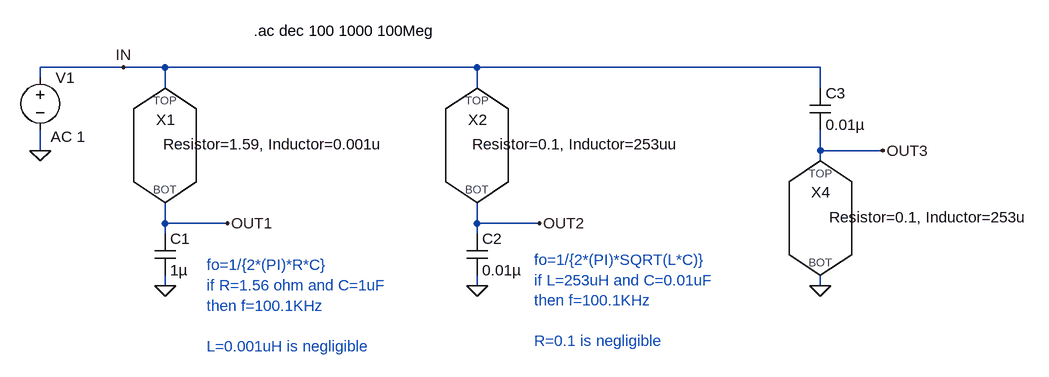
[diagram p0: schematic Fig_2-178_RL_Network-TOP_AC.asc]
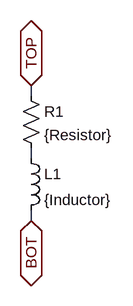
[diagram p1: sub-circuit fig_2-173_rl_element.asc]
Fig_2-178_RL_Network-TOP_AC.asc, the LTspice schematic file:
Version 4
SHEET 1 1832 680
WIRE 96 64 -32 64
WIRE 160 64 96 64
WIRE 640 64 160 64
WIRE 1168 64 640 64
WIRE -32 80 -32 64
WIRE 160 96 160 64
WIRE 640 96 640 64
WIRE 1168 96 1168 64
WIRE -32 192 -32 160
WIRE 1168 192 1168 160
WIRE 1264 192 1168 192
WIRE 1168 208 1168 192
WIRE 160 304 160 272
WIRE 256 304 160 304
WIRE 640 304 640 272
WIRE 736 304 640 304
WIRE 160 320 160 304
WIRE 640 320 640 304
WIRE 160 400 160 384
WIRE 640 400 640 384
WIRE 1168 400 1168 384
FLAG 160 400 0
FLAG -32 192 0
FLAG 256 304 OUT1
FLAG 640 400 0
FLAG 736 304 OUT2
FLAG 96 64 IN
FLAG 1168 400 0
FLAG 1264 192 OUT3
SYMBOL voltage -32 64 R0
WINDOW 3 -163 109 Left 2
WINDOW 123 16 107 Left 2
WINDOW 39 0 0 Left 2
SYMATTR Value ""
SYMATTR Value2 AC 1
SYMATTR InstName V1
SYMBOL cap 144 320 R0
SYMATTR InstName C1
SYMATTR Value 1µ
SYMBOL cap 624 320 R0
SYMATTR InstName C2
SYMATTR Value 0.01µ
SYMBOL cap 1152 96 R0
SYMATTR InstName C3
SYMATTR Value 0.01µ
SYMBOL Fig_2-173_RL_Element 160 160 R0
WINDOW 3 167 38 Bottom 2
SYMATTR InstName X1
SYMATTR Value Resistor=1.59, Inductor=0.001u
SYMATTR SpiceModel Fig_2-173_RL_Element.asc
SYMBOL Fig_2-173_RL_Element 640 160 R0
WINDOW 3 152 38 Bottom 2
SYMATTR InstName X2
SYMATTR Value Resistor=0.1, Inductor=253uu
SYMBOL Fig_2-173_RL_Element 1168 272 R0
WINDOW 3 167 38 Bottom 2
SYMATTR InstName X4
SYMATTR Value Resistor=0.1, Inductor=253u
SYMATTR SpiceModel Fig_2-173_RL_Element.asc
TEXT 296 8 Left 2 !.ac dec 100 1000 100Meg
TEXT 224 368 Left 2 ;fo=1/{2*(PI)*R*C}\nif R=1.56 ohm and C=1uF\nthen f=100.1KHz\n \nL=0.001uH is negligible
TEXT 728 360 Left 2 ;fo=1/{2*(PI)*SQRT(L*C)}\nif L=253uH and C=0.01uF\nthen f=100.1KHz\n \nR=0.1 is negligible

fig_2-173_rl_element.asc, the sub-circuit schematic file:
Version 4
SHEET 1 880 680
WIRE 192 96 192 80
WIRE 192 192 192 176
WIRE 192 288 192 272
FLAG 192 80 TOP
IOPIN 192 80 BiDir
FLAG 192 288 BOT
IOPIN 192 288 BiDir
SYMBOL res 176 80 R0
SYMATTR InstName R1
SYMATTR Value {Resistor}
SYMBOL ind 176 176 R0
SYMATTR InstName L1
SYMATTR Value {Inductor}

The netlist it stands for:
* Fig_2-178_RL_Network-TOP_AC.asc
V1 IN 0 AC 1
C1 OUT1 0 1µ
C2 OUT2 0 0.01µ
C3 IN OUT3 0.01µ
XX1 OUT1 IN fig_2-173_rl_element params: Resistor=1.59, Inductor=0.001u
XX2 OUT2 IN fig_2-173_rl_element params: Resistor=0.1, Inductor=253uu
XX4 0 OUT3 fig_2-173_rl_element params: Resistor=0.1, Inductor=253u

* block symbol definitions
.subckt fig_2-173_rl_element BOT TOP
R1 TOP N001 {Resistor}
L1 N001 BOT {Inductor}
.ends fig_2-173_rl_element

.ac dec 100 1000 100Meg
* fo=1/{2*(PI)*R*C}
* if R=1.56 ohm and C=1uF
* then f=100.1KHz
* L=0.001uH is negligible
* fo=1/{2*(PI)*SQRT(L*C)}
* if L=253uH and C=0.01uF
* then f=100.1KHz
* R=0.1 is negligible
.backanno
.end